# EAGLE design Relay_Shield (EAGLE 7.6.0)
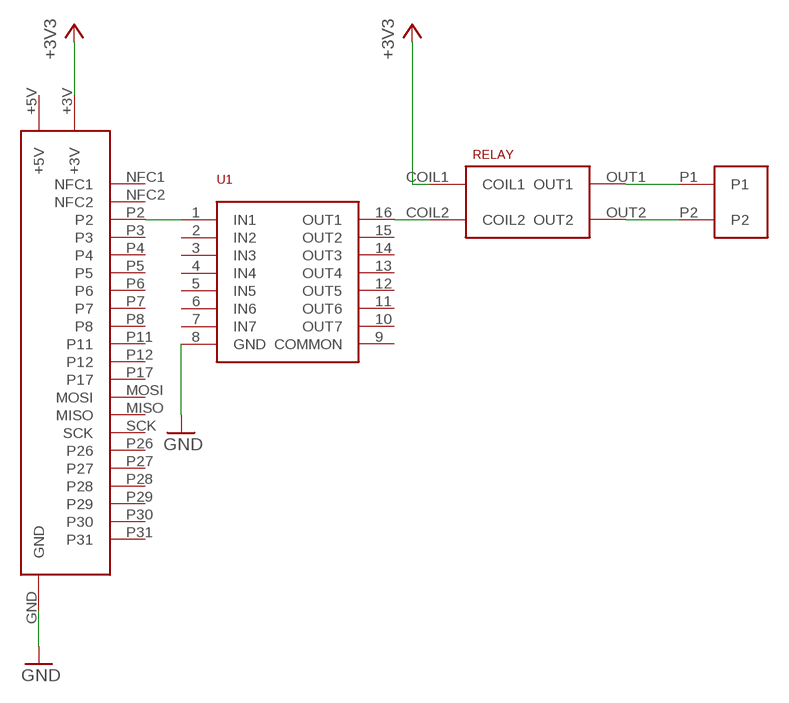
[diagram p0: schematic, sheet 1]

## Parts
RELAY  3V_RELAY_OZ-SS-103LM1  [3V_RELAY_OZ-SS-103LM1]
U1  ULN2003D1013TR  [SO16-NARROW]
U$1  EE02_SHIELD_HEADERSHIELD  [EE02_SHIELD_HEADER]
U$2  LOAD_TERMINAL_2P  [LOAD_CONNECTOR_2P]

## Nets
+3V3: RELAY.COIL1 U$1.+3V
GND: U1.8(GND) U$1.GND
N$1: U1.1(IN1) U$1.P2
N$6: RELAY.COIL2 U1.16(OUT1)
N$7: RELAY.OUT1 U$2.P1
N$8: RELAY.OUT2 U$2.P2
Unconnected: U1.2(IN2) U1.3(IN3) U1.4(IN4) U1.5(IN5) U1.6(IN6) U1.7(IN7) U1.9(COMMON) U1.10(OUT7) U1.11(OUT6) U1.12(OUT5) U1.13(OUT4) U1.14(OUT3) U1.15(OUT2) U$1.+5V U$1.MISO U$1.MOSI U$1.NFC1 U$1.NFC2 U$1.P3 U$1.P4 U$1.P5 U$1.P6 U$1.P7 U$1.P8 U$1.P11 U$1.P12 U$1.P17 U$1.P26 U$1.P27 U$1.P28 U$1.P29 U$1.P30 U$1.P31 U$1.SCK

## Library data of the parts
RELAY = EE:3V_RELAY_OZ-SS-103LM1
U1 = EE:ULN2003D1013TR
U$1 = EE:EE02_SHIELD_HEADER
U$2 = EE:LOAD_TERMINAL_2P

## Board
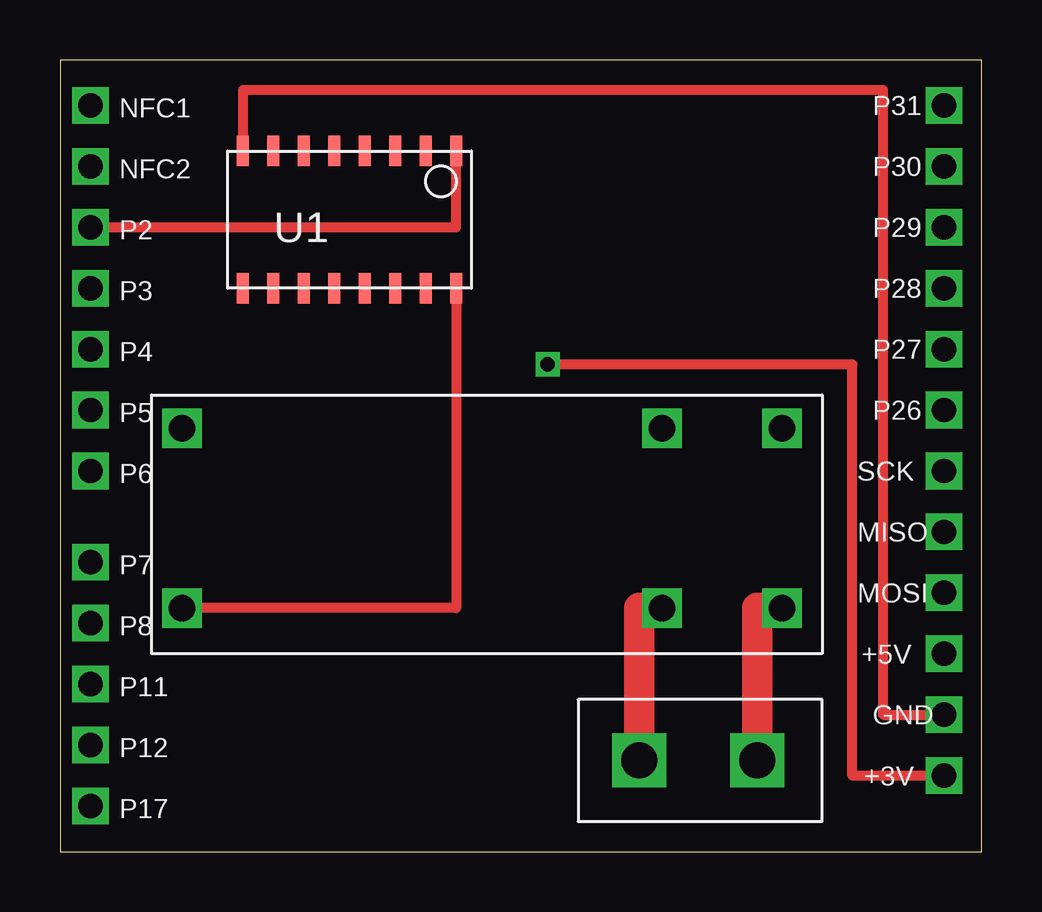
[diagram p1: board, top side]
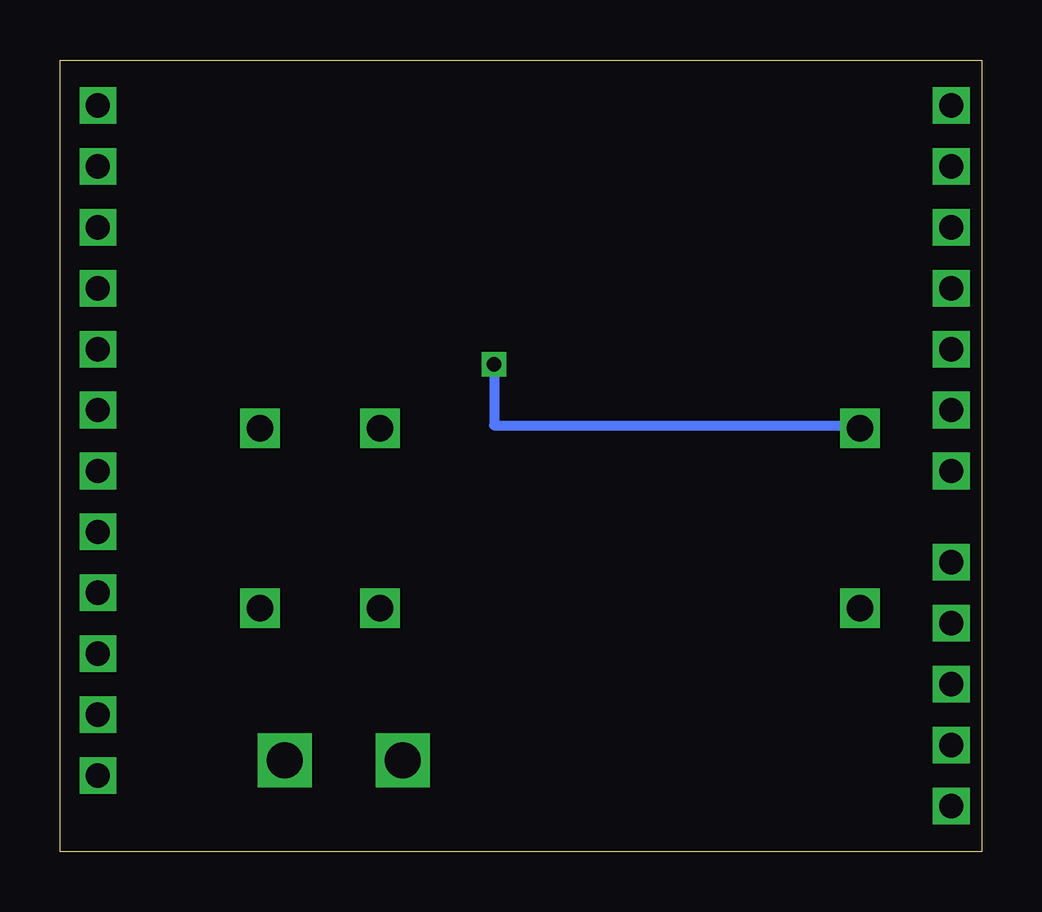
[diagram p2: board, bottom side, seen from below]

Size 38.41 x 33.01 mm. Coordinates in mm from the lower left corner, seen from the top.
Outline: 0,0 38.41,0 38.41,33.01 0,33.01 0,0
Copper layers (1*16): Top 0.035mm / dielectric 1.5mm / Bottom 0.035mm
Design rules "default": minimum track width 10mil, minimum drill 24mil, track to track 8mil, track to pad 8mil, pad to pad 8mil, via to via 8mil, smd to smd 8mil, copper to edge 40mil, drill to drill 8mil, minimum pad ring 10mil, minimum via ring 8mil, stop-mask expansion 4mil, vias tented up to drill 0mil, thermal gap 10mil

### Footprints (pad centres in the part's own frame; a part is rotated, then mirrored left to right if it is on the bottom)
3V_RELAY_OZ-SS-103LM1 = drill 1.1 square: COIL1 0,7.5; COIL2 0,0; OUT1 20,0; OUT2 25,0; P$4 20,7.5; P$6 25,7.5
SO16-NARROW = smd 1.27 x 0.5: 1 0,8.89; 2 0,7.62; 3 0,6.35; 4 0,5.08; 5 0,3.81; 6 0,2.54; 7 0,1.27; 8 0,0; 9 5.715,0; 10 5.715,1.27; 11 5.715,2.54; 12 5.715,3.81; 13 5.715,5.08; 14 5.715,6.35; 15 5.715,7.62; 16 5.715,8.89
EE02_SHIELD_HEADER = drill 1.016 square: +3V 35.56,2.54; +5V 35.56,7.62; GND 35.56,5.08; MISO 35.56,12.7; MOSI 35.56,10.16; NFC1 0,30.48; NFC2 0,27.94; P2 0,25.4; P3 0,22.86; P4 0,20.32; P5 0,17.78; P6 0,15.24; P7 0,11.43; P8 0,8.89; P11 0,6.35; P12 0,3.81; P17 0,1.27; P26 35.56,17.78; P27 35.56,20.32; P28 35.56,22.86; P29 35.56,25.4; P30 35.56,27.94; P31 35.56,30.48; SCK 35.56,15.24
LOAD_CONNECTOR_2P = drill 1.5 square: P1 0,0; P2 4.92,0

### Placement (x,y rotation side)
RELAY  5.08,10.16 0 top
U1  7.62,29.21 270 top
U$1  1.27,0.64 0 top
U$2  24.13,3.81 0 top

### Tracks (layer width: path | path; a pad name or v marks a point on that pad's centre or on a via)
+3V3  (via drill 0.6)
  Top 0.406: U$1.+3V 33.02,3.17 33.02,20.32 v20.32,20.32
  Bottom 0.406: v20.32,20.32 20.32,17.78 5.08,17.78 RELAY.COIL1
GND
  Top 0.406: U$1.GND 34.29,5.71 34.29,31.75 7.62,31.75 U1.8
N$1
  Top 0.406: U$1.P2 16.51,26.04 U1.1
N$6
  Top 0.406: U1.16 16.51,10.16 RELAY.COIL2
N$7
  Top 1.27: RELAY.OUT1 24.13,10.16 U$2.P1
N$8
  Top 1.27: RELAY.OUT2 29.05,10.16 U$2.P2